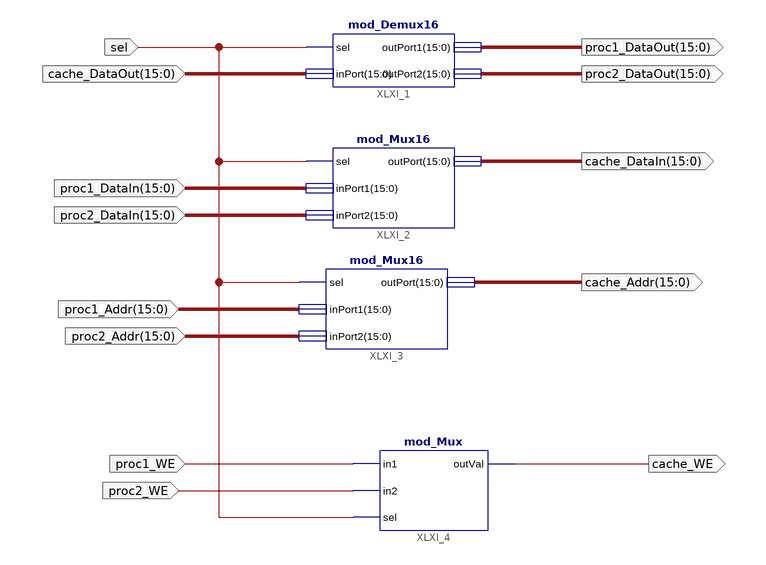
[diagram p0: schematic sheet 1]
// Xilinx ISE schematic mod_CacheMux.sch (spartan3e) as structural Verilog: 4 symbols, 13 ports
module mod_CacheMux (
  input  sel,
  input  [15:0] cache_DataOut,
  input  [15:0] proc1_DataIn,
  input  [15:0] proc2_DataIn,
  input  [15:0] proc1_Addr,
  input  [15:0] proc2_Addr,
  input  proc1_WE,
  input  proc2_WE,
  output [15:0] proc1_DataOut,
  output [15:0] proc2_DataOut,
  output [15:0] cache_DataIn,
  output [15:0] cache_Addr,
  output cache_WE
);

  mod_Demux16 XLXI_1 (.sel(sel), .inPort(cache_DataOut), .outPort1(proc1_DataOut), .outPort2(proc2_DataOut));
  mod_Mux16 XLXI_2 (.sel(sel), .inPort1(proc1_DataIn), .inPort2(proc2_DataIn), .outPort(cache_DataIn));
  mod_Mux16 XLXI_3 (.sel(sel), .inPort1(proc1_Addr), .inPort2(proc2_Addr), .outPort(cache_Addr));
  mod_Mux XLXI_4 (.in1(proc1_WE), .in2(proc2_WE), .sel(sel), .outVal(cache_WE));
endmodule
